# Altium schematic sheet 01DriverOccure.SchDoc
size A2
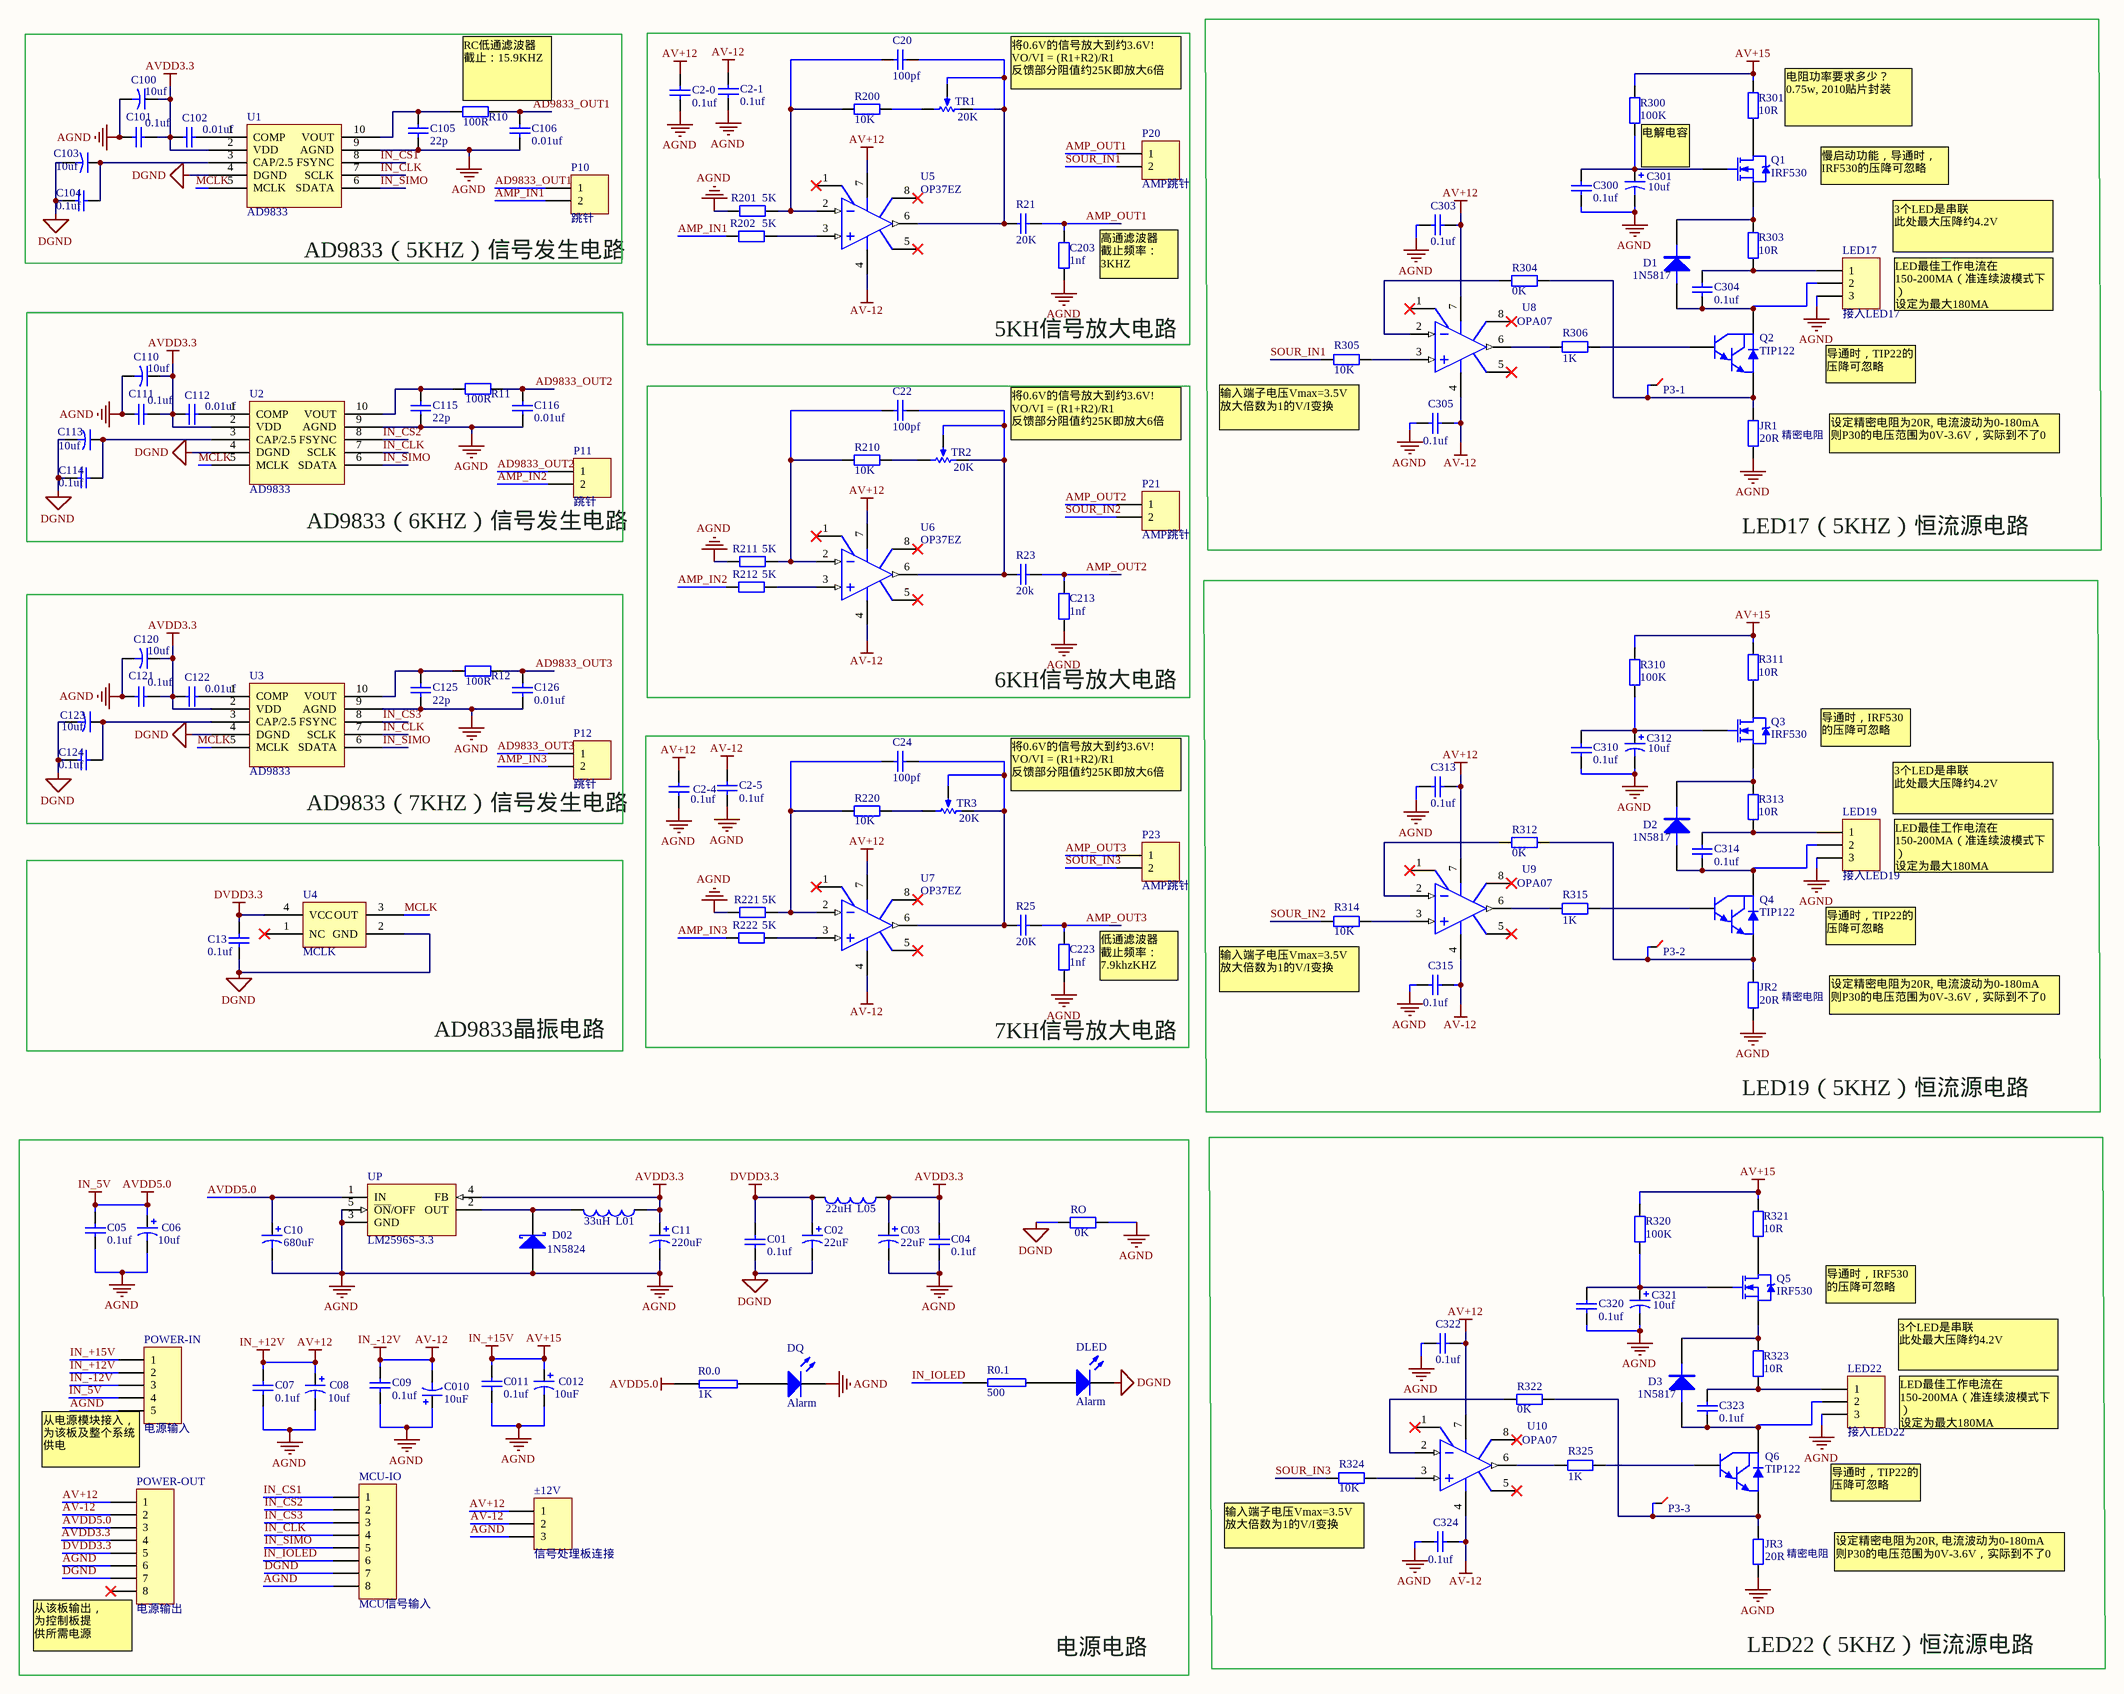
[diagram p0: 01DriverOccure.SchDoc]

## Parts
C01  value 0.1uf  [CC0805]  (hidden comment: Cap)
C02  value 22uF  [4*4.5 贴片电解电容]  (hidden comment: Cap Pol1)
C2-0  value 0.1uf  [CC0805]  (hidden comment: Cap)
C2-1  value 0.1uf  [CC0805]  (hidden comment: Cap)
C2-4  value 0.1uf  [CC0805]  (hidden comment: Cap)
C2-5  value 0.1uf  [CC0805]  (hidden comment: Cap)
C03  value 22uF  [4*4.5 贴片电解电容]  (hidden comment: Cap Pol1)
C04  value 0.1uf  [CC0805]  (hidden comment: Cap)
C05  value 0.1uf  [CC0805]  (hidden comment: Cap)
C06  value 10uf  [4*4.5 贴片电解电容]  (hidden comment: Cap Pol1)
C07  value 0.1uf  [CC0805]  (hidden comment: Cap)
C08  value 10uf  [4*4.5 贴片电解电容]  (hidden comment: Cap Pol1)
C09  value 0.1uf  [CC0805]  (hidden comment: Cap)
C10  value 680uF  [C-RB-S10]  (hidden comment: Cap Pol1)
C010  value 10uF  [4*4.5 贴片电解电容]  (hidden comment: Cap Pol1)
C11  value 220uF  [CAP-7343]  (hidden comment: Cap Pol1)
C011  value 0.1uf  [CC0805]  (hidden comment: Cap)
C012  value 10uF  [4*4.5 贴片电解电容]  (hidden comment: Cap Pol1)
C13  value 0.1uf  [CC0805]  (hidden comment: Cap)
C20  value 100pf  [CC0805]  (hidden comment: Cap)
C22  value 100pf  [CC0805]  (hidden comment: Cap)
C24  value 100pf  [CC0805]  (hidden comment: Cap)
C100  value 10uf  [CC0805]  (hidden comment: Cap2)
C101  value 0.1uf  [CC0805]  (hidden comment: Cap)
C102  value 0.01uf  [CC0805]  (hidden comment: Cap)
C103  value 10uf  [CC0805]  (hidden comment: Cap2)
C104  value 0.1uf  [CC0805]  (hidden comment: Cap)
C105  value 22p  [CC0805]  (hidden comment: Cap)
C106  value 0.01uf  [CC0805]  (hidden comment: Cap)
C110  value 10uf  [CC0805]  (hidden comment: Cap2)
C111  value 0.1uf  [CC0805]  (hidden comment: Cap)
C112  value 0.01uf  [CC0805]  (hidden comment: Cap)
C113  value 10uf  [CC0805]  (hidden comment: Cap2)
C114  value 0.1uf  [CC0805]  (hidden comment: Cap)
C115  value 22p  [CC0805]  (hidden comment: Cap)
C116  value 0.01uf  [CC0805]  (hidden comment: Cap)
C120  value 10uf  [CC0805]  (hidden comment: Cap2)
C121  value 0.1uf  [CC0805]  (hidden comment: Cap)
C122  value 0.01uf  [CC0805]  (hidden comment: Cap)
C123  value 10uf  [CC0805]  (hidden comment: Cap2)
C124  value 0.1uf  [CC0805]  (hidden comment: Cap)
C125  value 22p  [CC0805]  (hidden comment: Cap)
C126  value 0.01uf  [CC0805]  (hidden comment: Cap)
C203  value 1nf  [0805]  (hidden comment: Res2)
C213  value 1nf  [0805]  (hidden comment: Res2)
C223  value 1nf  [0805]  (hidden comment: Res2)
C300  value 0.1uf  [CC0805]  (hidden comment: Cap)
C301  value 10uf  [4*4.5 贴片电解电容]  (hidden comment: Cap Pol1)
C303  value 0.1uf  [CC0805]  (hidden comment: Cap)
C304  value 0.1uf  [CC0805]  (hidden comment: Cap)
C305  value 0.1uf  [CC0805]  (hidden comment: Cap)
C310  value 0.1uf  [CC0805]  (hidden comment: Cap)
C312  value 10uf  [4*4.5 贴片电解电容]  (hidden comment: Cap Pol1)
C313  value 0.1uf  [CC0805]  (hidden comment: Cap)
C314  value 0.1uf  [CC0805]  (hidden comment: Cap)
C315  value 0.1uf  [CC0805]  (hidden comment: Cap)
C320  value 0.1uf  [CC0805]  (hidden comment: Cap)
C321  value 10uf  [4*4.5 贴片电解电容]  (hidden comment: Cap Pol1)
C322  value 0.1uf  [CC0805]  (hidden comment: Cap)
C323  value 0.1uf  [CC0805]  (hidden comment: Cap)
C324  value 0.1uf  [CC0805]  (hidden comment: Cap)
D1  1N5817  [DIODE-SMA]
D2  1N5817  [DIODE-SMA]
D02  1N5824  [DIODE-SMA]
D3  1N5817  [DIODE-SMA]
DLED  Alarm  [LED_0805]
DQ  Alarm  [LED_0805]
JR1  value 20R  [FUSE]  (hidden comment: Res2)
JR2  value 20R  [FUSE]  (hidden comment: Res2)
JR3  value 20R  [FUSE]  (hidden comment: Res2)
L01  value 33uH  [L-SMD-7]  (hidden comment: Inductor)
L05  value 22uH  [1206]  (hidden comment: Inductor)
LED17  接入LED17  [HDR1X3H]
LED19  接入LED19  [HDR1X3H]
LED22  接入LED22  [HDR1X3H]
MCU-IO  MCU信号输入  [HDR1X8H]
P3-1  测试点  [Text_PAD]  (value not drawn)
P3-2  测试点  [Text_PAD]  (value not drawn)
P3-3  测试点  [Text_PAD]  (value not drawn)
P10  跳针  [HDR1X2]
P11  跳针  [HDR1X2]
P12  跳针  [HDR1X2]
P20  AMP跳针  [HDR1X2]
P21  AMP跳针  [HDR1X2]
P23  AMP跳针  [HDR1X2]
POWER-IN  电源输入  [5角弯式电源插座]
POWER-OUT  电源输出  [小立式电源接口]
Q1  IRF530  [TIP122-带卧式散热]
Q2  TIP122  [TIP122-带卧式散热]
Q3  IRF530  [TIP122-带卧式散热]
Q4  TIP122  [TIP122-带卧式散热]
Q5  IRF530  [TIP122-带卧式散热]
Q6  TIP122  [TIP122-带卧式散热]
R0.0  1K  [0805]
R0.1  500  [0805]
R10  value 100R  [0805]  (hidden comment: Res2)
R11  value 100R  [0805]  (hidden comment: Res2)
R12  value 100R  [0805]  (hidden comment: Res2)
R21  value 20K  [CC0805]  (hidden comment: Cap)
R23  value 20k  [CC0805]  (hidden comment: Cap)
R25  value 20K  [CC0805]  (hidden comment: Cap)
R200  value 10K  [0805]  (hidden comment: Res2)
R201  value 5K  [0805]  (hidden comment: Res2)
R202  value 5K  [0805]  (hidden comment: Res2)
R210  value 10K  [0805]  (hidden comment: Res2)
R211  value 5K  [0805]  (hidden comment: Res2)
R212  value 5K  [0805]  (hidden comment: Res2)
R220  value 10K  [0805]  (hidden comment: Res2)
R221  value 5K  [0805]  (hidden comment: Res2)
R222  value 5K  [0805]  (hidden comment: Res2)
R300  value 100K  [0805]  (hidden comment: Res2)
R301  value 10R  [2010贴片]  (hidden comment: Res2)
R303  value 10R  [2010贴片]  (hidden comment: Res2)
R304  value 0K  [0805]  (hidden comment: Res2)
R305  value 10K  [0805]  (hidden comment: Res2)
R306  value 1K  [0805]  (hidden comment: Res2)
R310  value 100K  [0805]  (hidden comment: Res2)
R311  value 10R  [2010贴片]  (hidden comment: Res2)
R312  value 0K  [0805]  (hidden comment: Res2)
R313  value 10R  [2010贴片]  (hidden comment: Res2)
R314  value 10K  [0805]  (hidden comment: Res2)
R315  value 1K  [0805]  (hidden comment: Res2)
R320  value 100K  [0805]  (hidden comment: Res2)
R321  value 10R  [2010贴片]  (hidden comment: Res2)
R322  value 0K  [0805]  (hidden comment: Res2)
R323  value 10R  [2010贴片]  (hidden comment: Res2)
R324  value 10K  [0805]  (hidden comment: Res2)
R325  value 1K  [0805]  (hidden comment: Res2)
RO  value 0K  [1206]  (hidden comment: Res2)
TR1  value 20K  [VR5]  (hidden comment: RPot)
TR2  value 20K  [VR5]  (hidden comment: RPot)
TR3  value 20K  [VR5]  (hidden comment: RPot)
U1  AD9833  [MSOP_AD9833_10N]
U2  AD9833  [MSOP_AD9833_10N]
U3  AD9833  [MSOP_AD9833_10N]
U4  MCLK  [X-CPX75]
U5  OP37EZ  [SO-8-N]
U6  OP37EZ  [SO-8-N]
U7  OP37EZ  [SO-8-N]
U8  OPA07  [SO-8-N]
U9  OPA07  [SO-8-N]
U10  OPA07  [SO-8-N]
UP  LM2596S-3.3  [LM2596S]
±12V  信号处理板连接  [HDR1X3H]

## Blocks framed on the sheet
AD9833（5KHZ）信号发生电路: C100-C106 P10 R10 U1
5KH信号放大电路: C2-0 C2-1 C20 C203 P20 R21 R200-R202 TR1 U5
LED17（5KHZ）恒流源电路: C300 C301 C303-C305 D1 JR1 LED17 P3-1 Q1 Q2 R300 R301 R303-R306 U8
AD9833（6KHZ）信号发生电路: C110-C116 P11 R11 U2
6KH信号放大电路: C22 C213 P21 R23 R210-R212 TR2 U6
AD9833（7KHZ）信号发生电路: C120-C126 P12 R12 U3
LED19（5KHZ）恒流源电路: C310 C312-C315 D2 JR2 LED19 P3-2 Q3 Q4 R310-R315 U9
7KH信号放大电路: C2-4 C2-5 C24 C223 P23 R25 R220-R222 TR3 U7
AD9833晶振电路: C13 U4
电源电路: C01 C02 C03 C04 C05 C06 C07 C08 C09 C010 C10 C011 C11 C012 D02 DLED DQ L01 L05 MCU-IO POWER-IN POWER-OUT R0.0 R0.1 RO UP ±12V
LED22（5KHZ）恒流源电路: C320-C324 D3 JR3 LED22 P3-3 Q5 Q6 R320-R325 U10

## Nets
AGND: C2-0.2 C2-1.2 C2-4.2 C2-5.2 C03.2 C04.2 C05.2 C06.2 C07.2 C08.2 C09.2 C010.1 C10.2 C11.2 C011.2 C012.2 C100.2 C101.2 C105.1 C106.1 C110.2 C111.2 C115.1 C116.1 C120.2 C121.2 C125.1 C126.1 C203.1 C213.1 C223.1 C300.2 C301.2 C303.1 C305.1 C310.2 C312.2 C313.1 C315.1 C320.2 C321.2 C322.1 C324.1 D02.1(A) DQ.2(K) JR1.2 JR2.2 JR3.2 LED17.3 LED19.3 LED22.3 MCU-IO.8 POWER-IN.5 POWER-OUT.6 R201.1 R211.1 R221.1 RO.1 U1.9(AGND) U2.9(AGND) U3.9(AGND) UP.3(GND) UP.5(~{ON}/OFF) ±12V.3
AV+12: C2-0.1 C2-4.1 C07.1 C08.1 C303.2 C313.2 C322.2 POWER-IN.2 POWER-OUT.1 U5.7(V+) U6.7(V+) U7.7(V+) U8.7(V+) U9.7(V+) U10.7(V+) ±12V.1  [also labelled IN_+12V]
AV-12: C2-1.1 C2-5.1 C09.1 C010.2 C305.2 C315.2 C324.2 POWER-IN.3 POWER-OUT.2 U5.4(V-) U6.4(V-) U7.4(V-) U8.4(V-) U9.4(V-) U10.4(V-) ±12V.2  [also labelled IN_-12V]
AVDD3.3: C03.1 C04.1 C11.1 C100.1 C101.1 C102.2 C110.1 C111.1 C112.2 C120.1 C121.1 C122.2 L01.1 L05.1 POWER-OUT.4 U1.2(VDD) U2.2(VDD) U3.2(VDD) UP.4(FB)
AVDD5.0: C05.1 C06.1 C10.1 POWER-IN.4 POWER-OUT.3 R0.0.2 UP.1(IN)  [also labelled IN_5V]
DGND: C01.2 C02.2 C13.2 C103.2 C104.2 C113.2 C114.2 C123.2 C124.2 DLED.2(K) MCU-IO.7 POWER-OUT.7 RO.2 U1.4(DGND) U2.4(DGND) U3.4(DGND) U4.2(GND)
DVDD3.3: C01.1 C02.1 C13.1 L05.2 POWER-OUT.5 U4.4(VCC)
IN_+15V: C011.1 C012.1 POWER-IN.1 R300.1 R301.1 R310.1 R311.1 R320.1 R321.1  [also labelled AV+15]
AD9833_OUT1: C106.2 P10.1 R10.2
AD9833_OUT2: C116.2 P11.1 R11.2
AD9833_OUT3: C126.2 P12.1 R12.2
AMP_IN1: P10.2 R202.1
AMP_IN2: P11.2 R212.1
AMP_IN3: P12.2 R222.1
AMP_OUT1: C203.2 P20.1 R21.1
AMP_OUT2: C213.2 P21.1 R23.1
AMP_OUT3: C223.2 P23.1 R25.1
IN_CLK: MCU-IO.4 U1.7(SCLK) U2.7(SCLK) U3.7(SCLK)
IN_CS1: MCU-IO.1 U1.8(FSYNC)
IN_CS2: MCU-IO.2 U2.8(FSYNC)
IN_CS3: MCU-IO.3 U3.8(FSYNC)
IN_IOLED: MCU-IO.6 R0.1.2
IN_SIMO: MCU-IO.5 U1.6(SDATA) U2.6(SDATA) U3.6(SDATA)
MCLK: U1.5(MCLK) U2.5(MCLK) U3.5(MCLK) U4.3(OUT)
SOUR_IN1: P20.2 R305.1
SOUR_IN2: P21.2 R314.1
SOUR_IN3: P23.2 R324.1
NetC20_1: C20.1 R21.2 TR1.1(TOP) TR1.2(TAP) U5.6(OUT)
NetC20_2: C20.2 R200.1 R201.2 U5.2(IN-)
NetC22_1: C22.1 R23.2 TR2.1(TOP) TR2.2(TAP) U6.6(OUT)
NetC22_2: C22.2 R210.1 R211.2 U6.2(IN-)
NetC24_1: C24.1 R25.2 TR3.1(TOP) TR3.2(TAP) U7.6(OUT)
NetC24_2: C24.2 R220.1 R221.2 U7.2(IN-)
NetC102_1: C102.1 U1.1(COMP)
NetC103_1: C103.1 C104.1 U1.3(CAP/2.5)
NetC105_2: C105.2 R10.1 U1.10(VOUT)
NetC112_1: C112.1 U2.1(COMP)
NetC113_1: C113.1 C114.1 U2.3(CAP/2.5)
NetC115_2: C115.2 R11.1 U2.10(VOUT)
NetC122_1: C122.1 U3.1(COMP)
NetC123_1: C123.1 C124.1 U3.3(CAP/2.5)
NetC125_2: C125.2 R12.1 U3.10(VOUT)
NetC300_1: C300.1 C301.1 Q1.1(G) R300.2
NetC304_1: C304.1 LED17.1 R303.1
NetC304_2: C304.2 D1.1(A) LED17.2 Q2.2(C)
NetC310_1: C310.1 C312.1 Q3.1(G) R310.2
NetC314_1: C314.1 LED19.1 R313.1
NetC314_2: C314.2 D2.1(A) LED19.2 Q4.2(C)
NetC320_1: C320.1 C321.1 Q5.1(G) R320.2
NetC323_1: C323.1 LED22.1 R323.1
NetC323_2: C323.2 D3.1(A) LED22.2 Q6.2(C)
NetD1_2: D1.2(K) Q1.3(S) R303.2
NetD2_2: D2.2(K) Q3.3(S) R313.2
NetD02_2: D02.2(K) L01.2 UP.2(OUT)
NetD3_2: D3.2(K) Q5.3(S) R323.2
NetDLED_1: DLED.1(A) R0.1.1
NetDQ_1: DQ.1(A) R0.0.1
NetJR1_1: JR1.1 P3-1.0 Q2.3(E) R304.2
NetJR2_1: JR2.1 P3-2.0 Q4.3(E) R312.2
NetJR3_1: JR3.1 P3-3.0 Q6.3(E) R322.2
NetQ1_2: Q1.2(D) R301.2
NetQ2_1: Q2.1(B) R306.1
NetQ3_2: Q3.2(D) R311.2
NetQ4_1: Q4.1(B) R315.1
NetQ5_2: Q5.2(D) R321.2
NetQ6_1: Q6.1(B) R325.1
NetR200_2: R200.2 TR1.3(BOT)
NetR202_2: R202.2 U5.3(IN+)
NetR210_2: R210.2 TR2.3(BOT)
NetR212_2: R212.2 U6.3(IN+)
NetR220_2: R220.2 TR3.3(BOT)
NetR222_2: R222.2 U7.3(IN+)
NetR304_1: R304.1 U8.2(IN-)
NetR305_2: R305.2 U8.3(IN+)
NetR306_2: R306.2 U8.6(OUT)
NetR312_1: R312.1 U9.2(IN-)
NetR314_2: R314.2 U9.3(IN+)
NetR315_2: R315.2 U9.6(OUT)
NetR322_1: R322.1 U10.2(IN-)
NetR324_2: R324.2 U10.3(IN+)
NetR325_2: R325.2 U10.6(OUT)

Not connected (* = marked no-connect by the designer): POWER-OUT 8*; U4 1(NC)*; U5 1(VOSTRIM)* 5(NC)* 8(VOSTRIM)*; U6 1(VOSTRIM)* 5(NC)* 8(VOSTRIM)*; U7 1(VOSTRIM)* 5(NC)* 8(VOSTRIM)*; U8 1(VOSTRIM)* 5(NC)* 8(VOSTRIM)*; U9 1(VOSTRIM)* 5(NC)* 8(VOSTRIM)*; U10 1(VOSTRIM)* 5(NC)* 8(VOSTRIM)*

## Notes on the sheet
- 将0.6V的信号放大到约3.6V!
  VO/VI = (R1+R2)/R1
  反馈部分阻值约25K即放大6倍
- (near R10) RC低通滤波器
  截止：15.9KHZ
- 电阻功率要求多少？
  0.75w, 2010贴片封装
- (near R300) 电解电容
- 慢启动功能，导通时，IRF530的压降可忽略
- (near U1) 应为AVDD3.3供电
- (near C203) 高通滤波器
  截止频率：3KHZ
- 3个LED是串联
  此处最大压降约4.2V
- (near U1) ad9833
  20mW
  6.7mA
- LED最佳工作电流在150-200MA（准连续波模式下）
  设定为最大180MA
- 导通时，TIP22的压降可忽略
- RC低通滤波器
  截止：159KHZ
- (near R305) 输入端子电压Vmax=3.5V
  放大倍数为1的V/I变换
- (near JR1) 精密电阻
- 设定精密电阻为20R, 电流波动为0-180mA
  则P30的电压范围为0V-3.6V，实际到不了0
- (near U2) ad9833
  20mW
  6.7mA
- (near U2) 应为AVDD3.3供电
- (near C213) 此处不可以高通滤波，改为低通滤波，电阻电容互换，截止频率为7.9khz
- 导通时，IRF530的压降可忽略
- ad9833
  20mW
  6.7mA
- (near U3) 应为AVDD3.3供电
- (near C223) 低通滤波器
  截止频率：7.9khzKHZ
- (near R314) 输入端子电压Vmax=3.5V
  放大倍数为1的V/I变换
- (near JR2) 精密电阻
- (near POWER-IN) 从电源模块接入，为该板及整个系统供电
- (near R324) 输入端子电压Vmax=3.5V
  放大倍数为1的V/I变换
- (near JR3) 精密电阻
- (near POWER-OUT) 从该板输出，
  为控制板提
  供所需电源

## Library data of the parts
C01 C2-0 C2-1 C2-4 C2-5 C04 C05 C07 C09 C011 C13 C20 C22 C24 C101 C102 C104-C106 C111 C112 C114-C116 C121 C122 C124-C126 C300 C303-C305 C310 C313-C315 C320 C322-C324 R21 R23 R25 = Cap: Capacitor; Published: 8-Jun-2000; LatestRevisionDate: 17-Jul-2002; LatestRevisionNote: Re-released for DXP Platform.; PackageReference: RAD-0.3; Publisher: Altium Limited
C02 C03 C06 C08 C10 C010 C11 C012 C301 C312 C321 = Cap Pol1: Polarized Capacitor (Radial); Published: 8-Jun-2000; LatestRevisionDate: 17-Jul-2002; LatestRevisionNote: Re-released for DXP Platform.; PackageReference: RB7.6-15; Publisher: Altium Limited
C100 C103 C110 C113 C120 C123 = Cap2: Capacitor; Published: 23-Sep-2002; PackageReference: CAPR5-4X5; Publisher: Altium Limited
C203 C213 C223 JR1-JR3 R10-R12 R200-R202 R210-R212 R220-R222 R300 R301 R303-R306 R310-R315 R320-R325 RO = Res2: Resistor; Published: 8-Jun-2000; LatestRevisionDate: 17-Jul-2002; LatestRevisionNote: Re-released for DXP Platform.; PackageReference: AXIAL-0.4; Publisher: Altium Limited
D1-D3 = DIODE
D02 = D Schottky: Schottky Diode; Published: 8-Jun-2000; LatestRevisionDate: 17-Jul-2002; LatestRevisionNote: Re-released for DXP Platform.; PackageReference: SMB; Publisher: Altium Limited; Code_JEDEC: DO-214-AA
DLED DQ = LED0: Typical INFRARED GaAs LED; Published: 8-Jun-2000; LatestRevisionDate: 08-Jul-2005; LatestRevisionNote: Mech Layer 1 removed.; PackageReference: LED-0; Publisher: Altium Limited
L01 L05 = Inductor: Code_IEC: 1005; Published: 8-Jun-2000; LatestRevisionDate: 29-May-2009; LatestRevisionNote: IPC-7351 Footprint Added.; PackageReference: 0402-A; Publisher: Altium Limited; PackageDescription: Chip Inductor; Code_JEITA: 0402
LED17 LED19 LED22 ±12V = Header 3H: Header, 3-Pin, Right Angle; LatestRevisionDate: 17-Jul-2002; LatestRevisionNote: Re-released for DXP Platform.; Publisher: Altium Limited
MCU-IO = Header 8H: Header, 8-Pin, Right Angle; LatestRevisionDate: 17-Jul-2002; LatestRevisionNote: Re-released for DXP Platform.; Publisher: Altium Limited
P10-P12 P20 P21 P23 = Header 2: Header, 2-Pin; LatestRevisionDate: 17-Jul-2002; LatestRevisionNote: Re-released for DXP Platform.; Publisher: Altium Limited
POWER-IN = Header 5H: Header, 5-Pin, Right Angle; LatestRevisionDate: 17-Jul-2002; LatestRevisionNote: Re-released for DXP Platform.; Publisher: Altium Limited
POWER-OUT = Header 8: Header, 8-Pin; LatestRevisionDate: 17-Jul-2002; LatestRevisionNote: Re-released for DXP Platform.; Publisher: Altium Limited
Q1 Q3 Q5 = NMOS-2: N-Channel Power MOSFET; Note: Pin 2 is electrically connected to pin 4.; Published: 8-Jun-2000; LatestRevisionDate: 17-Jul-2002; LatestRevisionNote: Re-released for DXP Platform.; DatasheetDocument: PD-9.814; PackageReference: TO-220AB; Publisher: Altium Limited; Code_JEDEC: TO-220-AB; ComponentLink1Description: Manufacturer Link; ComponentLink1URL: http://www.irf.com/
Q2 Q4 Q6 = NPN2: NPN Darlington Bipolar Transistor; Published: 8-Jun-2000; LatestRevisionDate: 17-Jul-2002; LatestRevisionNote: Re-released for DXP Platform.; PackageReference: TO-226; Publisher: Altium Limited; Code_JEDEC: TO-226-AE
R0.0 R0.1 = RES2
TR1-TR3 = RPot: Potentiometer; Sim Note: Enter the Resistance value and the set point into parameter fields.; Set Position: 0.5; Published: 8-Jun-2000; LatestRevisionDate: 17-Jul-2002; LatestRevisionNote: Re-released for DXP Platform.; PackageReference: VR5; Publisher: Altium Limited
U1-U3 = AD9833: 波形发生器
U4 = MCLK: 有源晶振1MHZ ,5V
U5-U7 = OP37EZ: Low-Noise, Precision, High-Speed Operational Amplifier (Avcl >= 5); Note: Pin 5 is not connected.; Published: 8-Jun-2000; LatestRevisionDate: 04-Mar-2005; LatestRevisionNote: Stylized 3D Model Added.; DatasheetVersion: 1992; PackageVersion: 1998; PackageReference: Q-8; Publisher: Altium Limited; PackageDescription: DIP; 8 Leads; Row Spacing 7.62 mm; Pitch 2.54 mm; ComponentLink1Description: Manufacturer Link; ComponentLink1URL: http://www.analog.com/en/prod/0,,759_786_OP37%2C00.html; ComponentLink2Description: Datasheet; ComponentLink2URL: http://www.analog.com/UploadedFiles/Data_Sheets/5021673OP37_b.pdf
U8-U10 = OP37GS: Low-Noise, Precision, High-Speed Operational Amplifier (Avcl >= 5); Note: Pin 5 is not connected.; Published: 8-Jun-2000; LatestRevisionDate: 13-Apr-2006; LatestRevisionNote: IPC-7351 Footprint Added.; DatasheetVersion: 1992; PackageVersion: revA; PackageReference: SO-8; Publisher: Altium Limited; PackageDescription: 8-Pin Small Outline Integrated Circuit 1.27 mm Pitch; Code_JEDEC: MS-012-AA; Code_IPC: SOIC127P600-8; ComponentLink1Description: Manufacturer Link; ComponentLink1URL: http://www.analog.com/en/prod/0,,759_786_OP37%2C00.html; ComponentLink2Description: Datasheet; ComponentLink2URL: http://www.analog.com/UploadedFiles/Data_Sheets/5021673OP37_b.pdf
UP = LM2596S-5.0: Simple Switcher Power Converter 150 kHz 3A Step Down Voltage Regulator; Note: Tab is connected to GND; Published: 15-Apr-2002; DatasheetVersion: Dec-1997; PackageReference: TS5B; Publisher: Altium Limited; PackageDescription: D2-PAK; 5 Leads; Body 14.4 (inc. leads) x 10.4 mm (LxW max); ComponentLink1Description: Manufacturer Link; ComponentLink1URL: http://www.national.com/; ComponentLink2Description: Datasheet; ComponentLink2URL: http://www.national.com/ds.cgi/LM/LM2596.pdf; ComponentLink3Description: URL Link1; ComponentLink3URL: http://www.national.com/pf/LM/LM2596.html